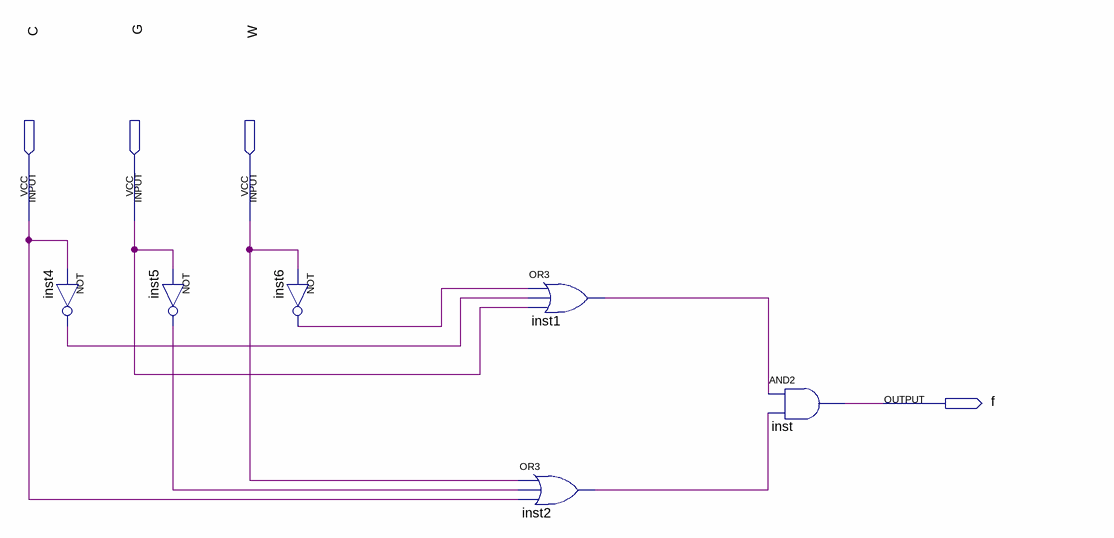
[diagram p0: schematic sheet]
// Quartus schematic lab3step0.bdf as structural Verilog: 6 symbols, 4 pins
module lab3step0 (
  input  C,
  input  G,
  input  W,
  output f
);

  wire inst1_out, inst2_out, inst4_out, inst5_out, inst6_out;

  not inst4 (inst4_out, C);
  not inst5 (inst5_out, G);
  not inst6 (inst6_out, W);
  or inst1 (inst1_out, inst6_out, inst4_out, G);
  or inst2 (inst2_out, W, inst5_out, C);
  and inst (f, inst1_out, inst2_out);
endmodule
